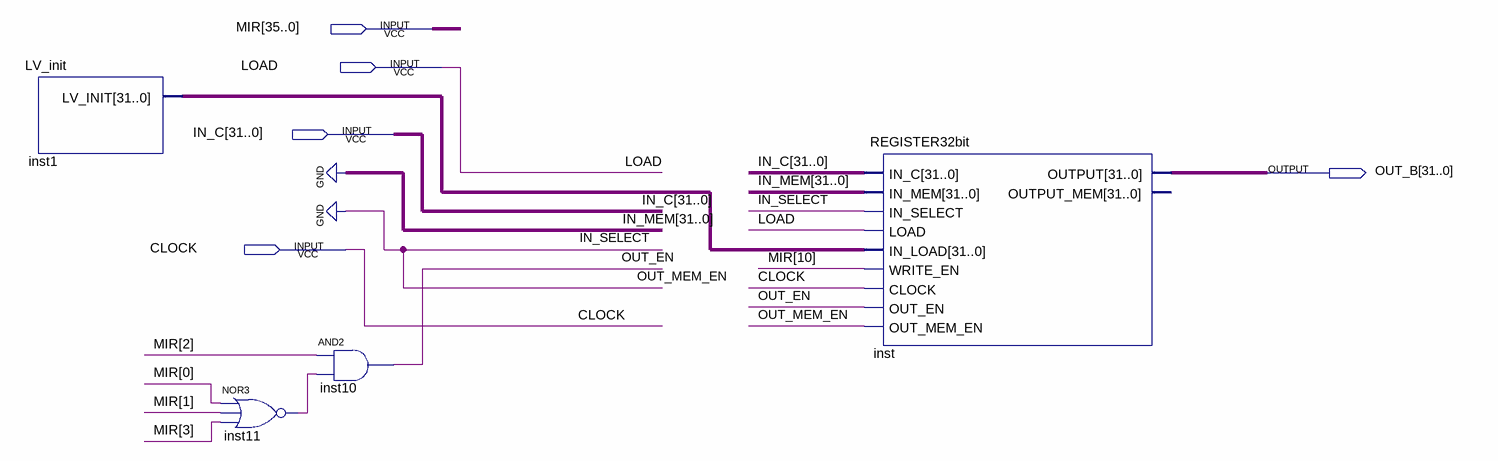
[diagram p0: schematic sheet]
// Quartus schematic SP.bdf as structural Verilog: 4 symbols, 5 pins
module SP (
  input  [35:0] MIR,
  input  LOAD,
  input  [31:0] IN_C,
  input  CLOCK,
  output [31:0] OUT_B
);

  wire inst11_out, OUT_EN;
  wire [31:0] inst1_lv_init;

  LV_init inst1 (.LV_INIT(inst1_lv_init));
  nor inst11 (inst11_out, MIR[0], MIR[1], MIR[3]);
  and inst10 (OUT_EN, MIR[2], inst11_out);
  REGISTER32bit inst (
    .IN_C(IN_C), .IN_MEM({32{1'b0}}), .IN_SELECT(1'b0), .LOAD(LOAD), .IN_LOAD(inst1_lv_init),
    .WRITE_EN(MIR[10]), .CLOCK(CLOCK), .OUT_EN(OUT_EN), .OUT_MEM_EN(1'b0), .OUTPUT(OUT_B));  // open: OUTPUT_MEM
endmodule
